# Altium project Mynd_BAFFLE.PrjPcb
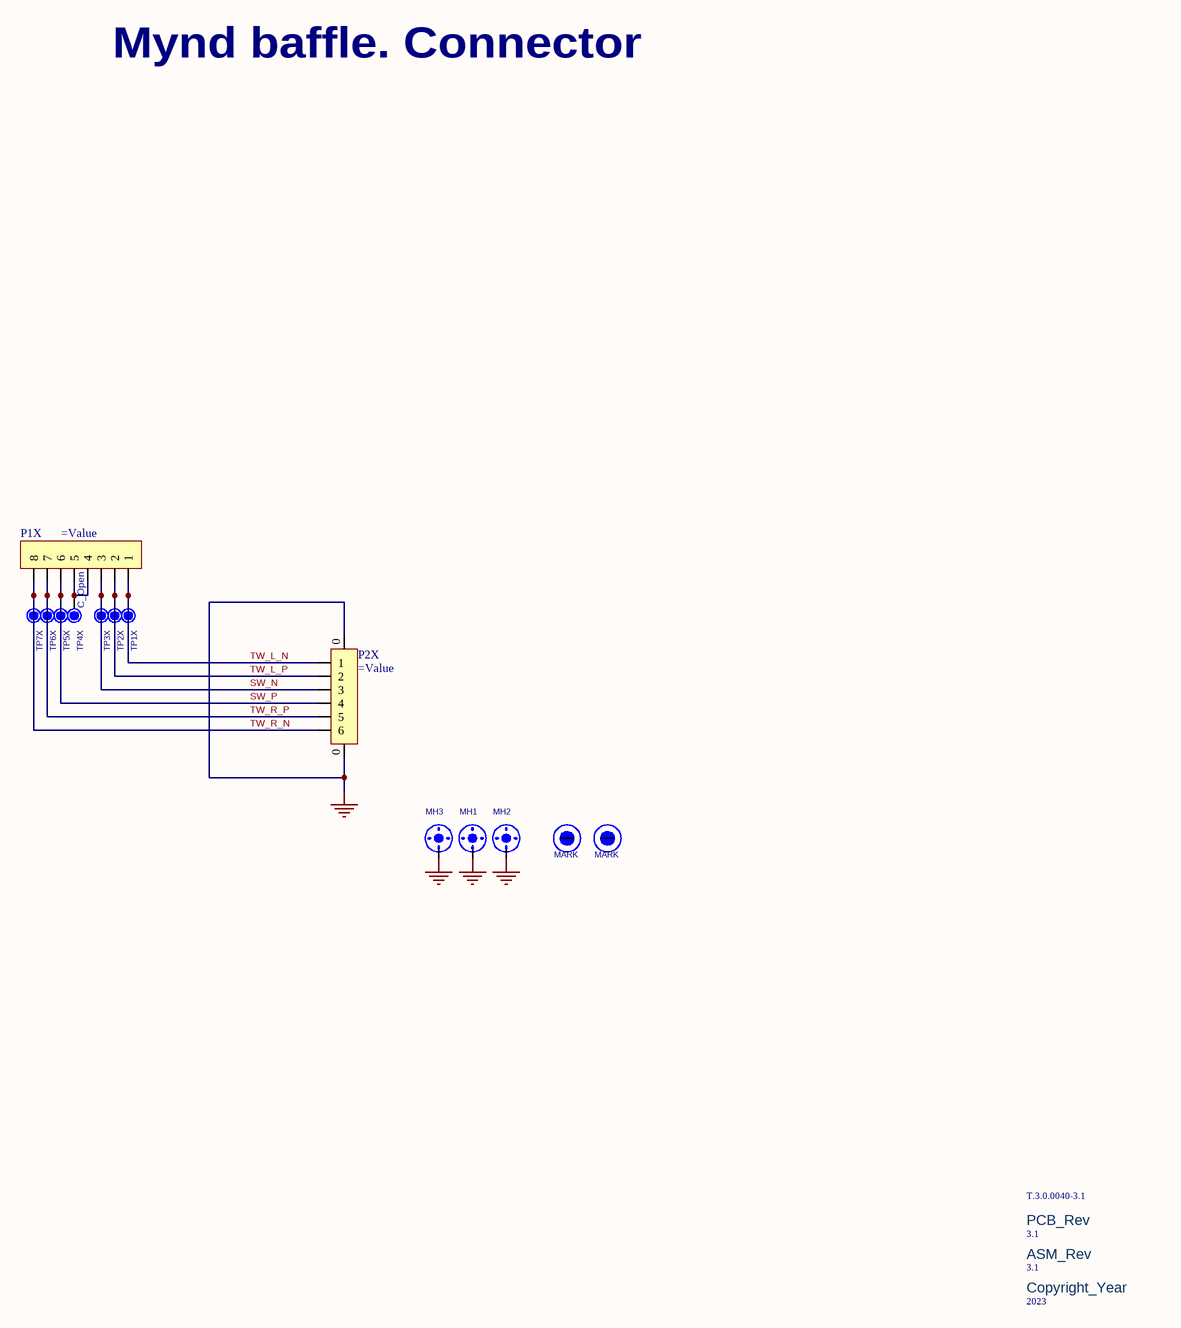
[diagram p0: Mynd_Baffle.SchDoc]
Version: T.3.0.0040; SCH_REV: 2.1; SCH_Designer: Guohhui.lin; SCH_Checker: aileen.zheng; SCH_Approver: jianhua.zhong; Revision: 3.1; QBOM-L-NUMBER: LFGPS2307-H001; QBOM-APEQ-NUMBER: APEPS2307-Q0G1; QBOM-APE-NUMBER: APEPS2307-00G1; QBOM-AIEQ-NUMBER: AIEPS2307-Q0G1; Projects.TemplateItemRevisionGuid: B682C188-0E56-4AC2-9775-457A46DFECEF; PCB_REV: 3.1; Engineer: JMB, TB, JM; DOC_NO_SCH_DWG: Mynd_Baffle; Copyright_Year: 2023; CompanyName: Lautsprecher Teufel GmbH; ASM_Rev: 3.1; Address3: Germany; Address2: 10787 Berlin; Address1: Budapester Straße 44
1 sheet, 18 parts. Net scope: global (net labels, ports and power ports of the same name join across sheets).
Board file: Mynd_Baffle.PcbDoc

## Sheet Mynd_Baffle.SchDoc: Mynd-Baffle_Conn
size A3; ApprovedBy: Jianhua.zhong; CheckedBy: Aileen.zheng; DrawnBy: Guohui.Lin; Revision: 3.1; SheetNumber: 1; SheetTotal: 1; Model NO.: PS2307; ISSUE DATE: 20230812; REV DATE: 20231025

### Parts
MH1  SCREW_HOLE_D35  [SCREW_D35]  (value not drawn)  (no BOM)
MH2  HOLD_D35  [HOLD_D35]  (value not drawn)  (no BOM)
MH3  SCREW_HOLE_D35  [SCREW_D35]  (value not drawn)  (no BOM)
MK1X  MARK  [MARK]  (no BOM)
MK2X  MARK  [MARK]  (no BOM)
P1X  (no value)  [TSB1_05282]
P2X  (no value)  [CON_250_SMD_V_6P]
Teufel_ASM_Label1X  3.1  [Teufel_ASM_Rev]  (no BOM)
Teufel_Copyright1X  2023  [TEUFEL_COPYRIGHT]  (no BOM)
Teufel_PCB_Label1X  3.1  [Teufel_PCB_Rev]  (no BOM)
Teufel_PCB_Logo1X  T.3.0.0040-3.1  [Teufel_NoLogo]  (no BOM)
TP1X  TP12  [TP120]  (value not drawn)  (no BOM)
TP2X  TP12  [TP120]  (value not drawn)  (no BOM)
TP3X  TP12  [TP120]  (value not drawn)  (no BOM)
TP4X  TP12  [TP120]  (value not drawn)  (no BOM)
TP5X  TP12  [TP120]  (value not drawn)  (no BOM)
TP6X  TP12  [TP120]  (value not drawn)  (no BOM)
TP7X  TP12  [TP120]  (value not drawn)  (no BOM)

### Nets
GND: MH1.1 MH2.1 MH3.1 P2X.0
SW_N: P1X.3 P2X.3 TP3X.1
SW_P: P1X.6 P2X.4 TP5X.1
TW_L_N: P1X.1 P2X.1 TP1X.1
TW_L_P: P1X.2 P2X.2 TP2X.1
TW_R_N: P1X.8 P2X.6 TP7X.1
TW_R_P: P1X.7 P2X.5 TP6X.1
NetP1X_4: P1X.4 P1X.5 TP4X.1

Not connected (* = marked no-connect by the designer): MK1X MK_B MK_T; MK2X MK_B MK_T

### Notes on the sheet
- Mynd baffle. Connector
- (near TP4X) C_Open
- Revision:
- Lautspreecher Teufel GmbH
- Budapester Straße 44
- 10787 Berlin
- Germany
- Page Title:
- Engineer:
- Project:
- Version:
- Rev:
- modified:
- Date:
- Size:
- A3
- File Name:
- Page:
- of
- (in symbol CMP-00086-3) Copyright_Year
- (in symbol CMP-00087-3) PCB_Rev
- (in symbol CMP-00088-3) ASM_Rev

### Library data of the parts
MH1 MH3 = CMP-00005-2: SCREW_HOLE D3.5mm
MH2 = CMP-00019-1
MK1X MK2X = N-001-00003-2: MARK DOT; Design Item ID: MARK
P1X = C-001-0506-10: SMD BTB CONNECTOR 8P P2.5mm GOLD; Manufacturer: Generic; Part_Number: 8P PITCH=2.5mm; Part_Type: Connector BTB SMT; Value: 8P PITCH=2.5mm; System: Connector
P2X = C-001-0375-18: GS SMD WTB CONNECTOR 6P P2.5mm; Manufacturer: Generic; Part_Number: 6P PITCH=2.5mm; Part_Type: Connector WTB SMT; Value: 6P PITCH=2.5mm; System: Connector
Teufel_ASM_Label1X = CMP-00088-3: Teufel_ASM_Rev; Value: 3.1
Teufel_Copyright1X = CMP-00086-3: Teufel_Copyright_Year; Value: 2023
Teufel_PCB_Label1X = CMP-00087-3: Teufel_PCB_Label; Value: 3.1
Teufel_PCB_Logo1X = Teufel NoLogo: Teufel PCB NoLogo
TP1X TP2X TP3X TP4X TP5X TP6X TP7X = N-001-00010-2: Test Point; Design Item ID: TP

## Assembly variants
Variant-of-NotFitted-Project: all parts fitted